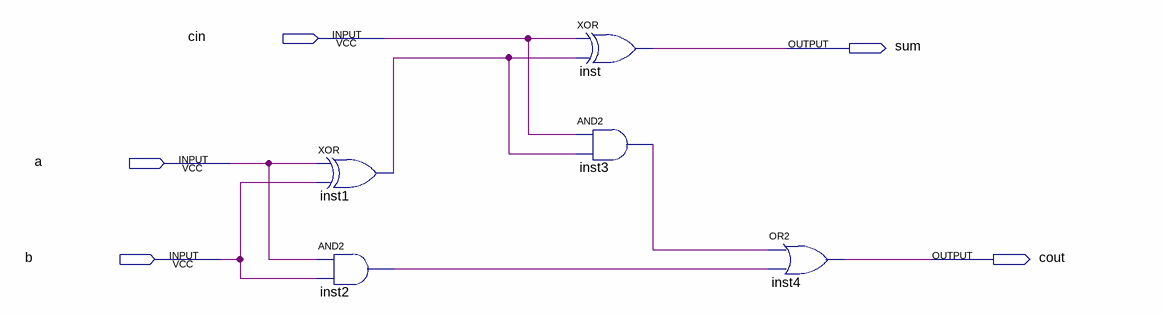
[diagram p0: schematic sheet]
// Quartus schematic full_adder.bdf as structural Verilog: 5 symbols, 5 pins
module full_adder (
  input  cin,
  input  a,
  input  b,
  output sum,
  output cout
);

  wire inst1_out, inst2_out, inst3_out;

  xor inst1 (inst1_out, a, b);
  and inst2 (inst2_out, a, b);
  xor inst (sum, cin, inst1_out);
  and inst3 (inst3_out, cin, inst1_out);
  or inst4 (cout, inst3_out, inst2_out);
endmodule
